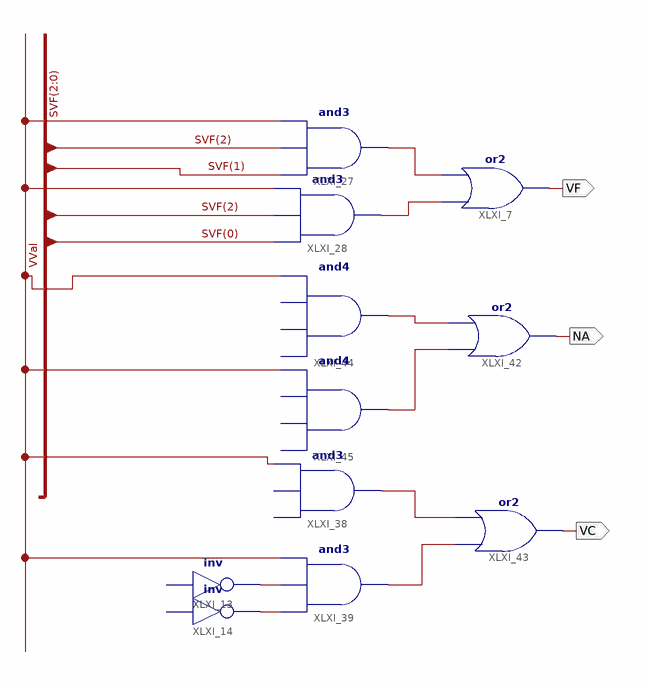
[diagram p0: schematic sheet 1]
// Xilinx ISE schematic Resultado_Votacion.sch (spartan6) as structural Verilog: 11 symbols, 3 ports
module Resultado_Votacion (
  output VC,
  output VF,
  output NA
);

  wire VVal, XLXN_3, XLXN_5, XLXN_6, XLXN_8, XLXN_9, XLXN_52, XLXN_74, XLXN_77;
  wire [2:0] SVF;

  and XLXI_28 (XLXN_52, SVF[0], SVF[2], VVal);
  and XLXI_27 (XLXN_74, SVF[1], SVF[2], VVal);
  or XLXI_7 (VF, XLXN_52, XLXN_74);
  buf XLXI_38 (XLXN_5, VVal);  // and3 open: I0, I1
  and XLXI_39 (XLXN_6, XLXN_9, XLXN_8, VVal);
  // inv XLXI_14 has open pins: I=open, O=XLXN_9
  // inv XLXI_13 has open pins: I=open, O=XLXN_8
  or XLXI_42 (NA, XLXN_77, XLXN_3);
  or XLXI_43 (VC, XLXN_6, XLXN_5);
  buf XLXI_44 (XLXN_3, VVal);  // and4 open: I0, I1, I2
  buf XLXI_45 (XLXN_77, VVal);  // and4 open: I0, I1, I2
endmodule
